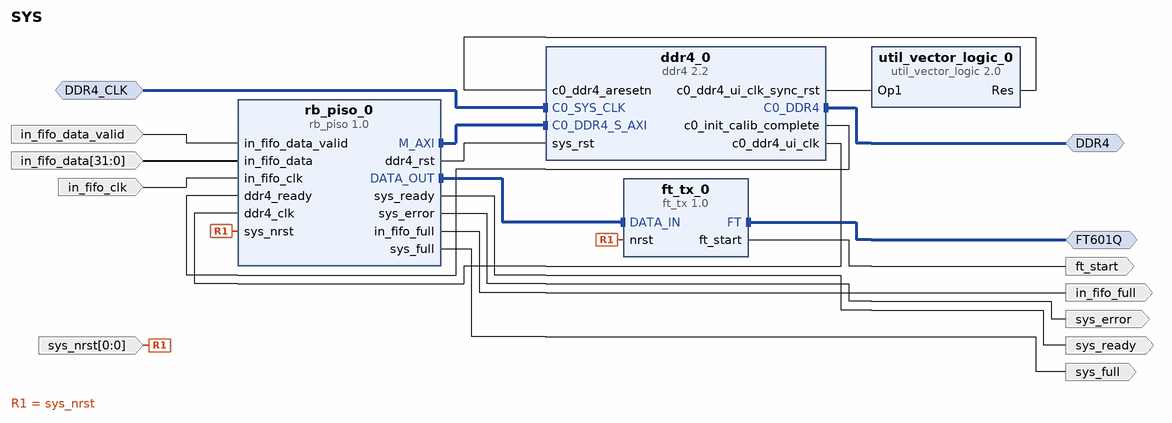
[diagram p0: block diagram of the top level]
# Vivado block design SYS, xcvu9p-flga2104-2L-e, Vivado 2019.1
create_bd_design SYS

create_bd_intf_port -mode Master -vlnv xilinx.com:interface:ddr4_rtl:1.0 DDR4
create_bd_intf_port -mode Slave -vlnv xilinx.com:interface:diff_clock_rtl:1.0 DDR4_CLK
set_property -dict {CONFIG.FREQ_HZ 250000000} [get_bd_intf_ports DDR4_CLK]
create_bd_intf_port -mode Master -vlnv xilinx.com:user:FT601Q_rtl:1.0 FT601Q
create_bd_port -dir I -from 0 -to 0 sys_nrst
create_bd_port -dir O sys_ready
create_bd_port -dir O sys_error
create_bd_port -dir O sys_full
create_bd_port -dir O in_fifo_full
create_bd_port -dir I in_fifo_data_valid
create_bd_port -dir I -from 31 -to 0 in_fifo_data
create_bd_port -dir I -type clk in_fifo_clk
create_bd_port -dir O ft_start

create_bd_cell -type ip -vlnv xilinx.com:user:rb_piso:1.0 rb_piso_0
create_bd_cell -type ip -vlnv xilinx.com:ip:ddr4:2.2 ddr4_0
set_property -dict [list \
  CONFIG.ADDN_UI_CLKOUT1_FREQ_HZ None \
  CONFIG.C0_CLOCK_BOARD_INTERFACE default_250mhz_clk2 \
  CONFIG.C0_DDR4_BOARD_INTERFACE ddr4_sdram_c2 \
] [get_bd_cells ddr4_0]
create_bd_cell -type ip -vlnv xilinx.com:ip:util_vector_logic:2.0 util_vector_logic_0
set_property -dict {CONFIG.C_OPERATION not CONFIG.C_SIZE 1} [get_bd_cells util_vector_logic_0]
create_bd_cell -type ip -vlnv xilinx.com:user:ft_tx:1.0 ft_tx_0

# ---- connections ----

connect_bd_intf_net [get_bd_intf_ports FT601Q] [get_bd_intf_pins ft_tx_0/FT]
connect_bd_intf_net [get_bd_intf_ports DDR4] [get_bd_intf_pins ddr4_0/C0_DDR4]
connect_bd_intf_net [get_bd_intf_pins rb_piso_0/M_AXI] [get_bd_intf_pins ddr4_0/C0_DDR4_S_AXI]
connect_bd_intf_net [get_bd_intf_pins rb_piso_0/DATA_OUT] [get_bd_intf_pins ft_tx_0/DATA_IN]
connect_bd_intf_net -intf_net default_250mhz_clk2_1 [get_bd_intf_ports DDR4_CLK] [get_bd_intf_pins ddr4_0/C0_SYS_CLK]
connect_bd_net [get_bd_pins ddr4_0/c0_ddr4_ui_clk_sync_rst] [get_bd_pins util_vector_logic_0/Op1]
connect_bd_net [get_bd_pins util_vector_logic_0/Res] [get_bd_pins ddr4_0/c0_ddr4_aresetn]
connect_bd_net [get_bd_pins rb_piso_0/sys_ready] [get_bd_ports sys_ready]
connect_bd_net [get_bd_pins rb_piso_0/sys_error] [get_bd_ports sys_error]
connect_bd_net [get_bd_pins rb_piso_0/sys_full] [get_bd_ports sys_full]
connect_bd_net [get_bd_pins rb_piso_0/ddr4_rst] [get_bd_pins ddr4_0/sys_rst]
connect_bd_net [get_bd_ports sys_nrst] [get_bd_pins rb_piso_0/sys_nrst] [get_bd_pins ft_tx_0/nrst]
connect_bd_net [get_bd_pins ddr4_0/c0_init_calib_complete] [get_bd_pins rb_piso_0/ddr4_ready]
connect_bd_net [get_bd_pins ddr4_0/c0_ddr4_ui_clk] [get_bd_pins rb_piso_0/ddr4_clk]
connect_bd_net [get_bd_pins rb_piso_0/in_fifo_full] [get_bd_ports in_fifo_full]
connect_bd_net -net in_fifo_data_valid_0_1 [get_bd_ports in_fifo_data_valid] [get_bd_pins rb_piso_0/in_fifo_data_valid]
connect_bd_net -net in_fifo_data_0_1 [get_bd_ports in_fifo_data] [get_bd_pins rb_piso_0/in_fifo_data]
connect_bd_net -net in_fifo_clk_0_1 [get_bd_ports in_fifo_clk] [get_bd_pins rb_piso_0/in_fifo_clk]
connect_bd_net [get_bd_pins ft_tx_0/ft_start] [get_bd_ports ft_start]

# ---- address map ----
assign_bd_address -offset 0x00000000 -range 2G -target_address_space [get_bd_addr_spaces rb_piso_0/M_AXI] [get_bd_addr_segs ddr4_0/C0_DDR4_MEMORY_MAP/C0_DDR4_ADDRESS_BLOCK]

validate_bd_design
save_bd_design
